# EAGLE design shield (EAGLE 6.1)
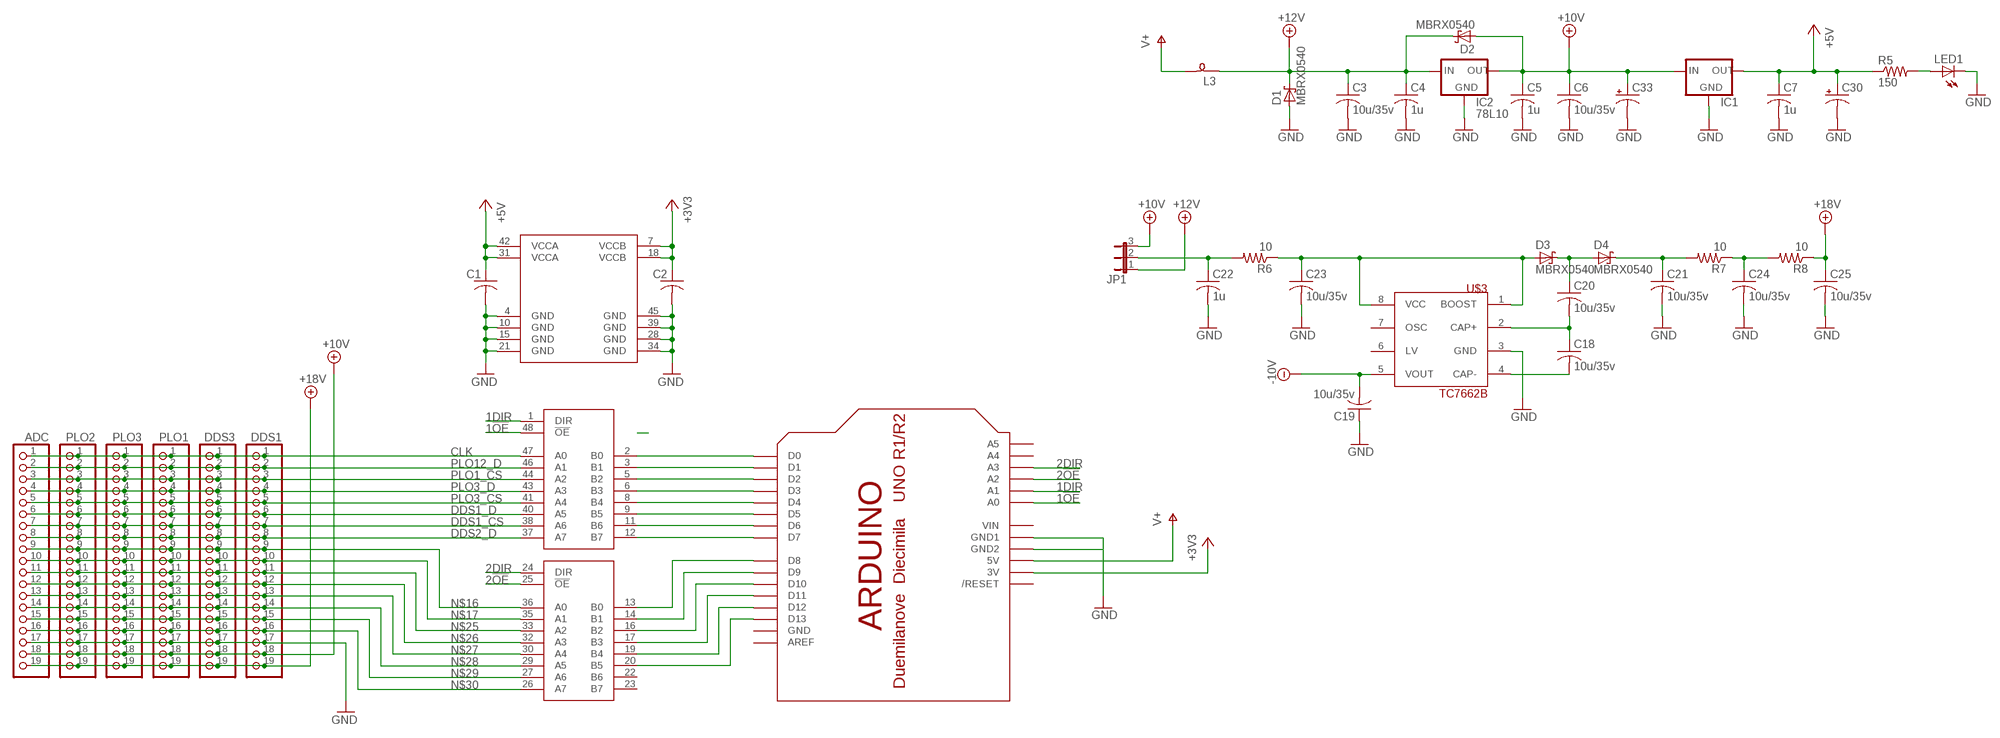
[diagram p0: schematic, sheet 1]

## Parts
ADC  PINHD-1X19  [1X19]
C1  C-USC0805  [C0805]
C2  C-USC0805  [C0805]
C3  10u/35v  C-USC1206  [C1206]
C4  1u  C-USC0603  [C0603]
C5  1u  C-USC0603  [C0603]
C6  10u/35v  C-USC1206  [C1206]
C7  1u  C-USC0603  [C0603]
C18  10u/35v  C-USC1206  [C1206]
C19  10u/35v  C-USC1206  [C1206]
C20  10u/35v  C-USC1206  [C1206]
C21  10u/35v  C-USC1206  [C1206]
C22  1u  C-USC0603  [C0603]
C23  10u/35v  C-USC1206  [C1206]
C24  10u/35v  C-USC1206  [C1206]
C25  10u/35v  C-USC1206  [C1206]
C30  CPOL-USE2.5-6  [E2,5-6]
C33  CPOL-USE2.5-6  [E2,5-6]
D1  MBRX0540  [SOD323-R]
D2  MBRX0540  [SOD323-R]
D3  MBRX0540  [SOD323-R]
D4  MBRX0540  [SOD323-R]
DDS1  PINHD-1X19  [1X19]
DDS3  PINHD-1X19  [1X19]
IC1  78MXXLSOT-89  [SOT89-BCE]
IC2  78L10  78XXS  [78XXS]
JP1  JP2E  [JP2]
L3  SM-B5  [SM-B5]
LED1  LED5MM  [LED5MM]
PLO1  PINHD-1X19  [1X19]
PLO2  PINHD-1X19  [1X19]
PLO3  PINHD-1X19  [1X19]
R5  150  R-US_R0603  [R0603]
R6  10  R-US_R0603  [R0603]
R7  10  R-US_R0603  [R0603]
R8  10  R-US_R0603  [R0603]
U$1  ARDUINO-NOHOLE  [ARDUINO-NOHOLE]
U$2  74ALVC164245DL  [SSO48]
U$3  TC7662B  [SO-08]

## Nets
1!OE: U$1.A0 U$2.48(1:!OE)
1DIR: U$1.A1 U$2.1(1:DIR)
2!OE: U$1.A2 U$2.25(2:!OE)
2DIR: U$1.A3 U$2.24(2:DIR)
+3V3: C2.1 U$1.3V U$2.7(VCCB) U$2.18(VCCB)
+5V: C1.1 C7.1 C30.+ IC1.B(OUT) R5.1 U$2.31(VCCA) U$2.42(VCCA)
+10V: ADC.18 C5.1 C6.1 C33.+ D2.A DDS1.18 DDS3.18 IC1.E(IN) IC2.OUT JP1.3 PLO1.18 PLO2.18 PLO3.18
+12V: C3.1 C4.1 D1.C D2.C IC2.IN JP1.1 L3.1
+18V: ADC.19 C25.1 DDS1.19 DDS3.19 PLO1.19 PLO2.19 PLO3.19 R8.1
-10V: C19.2 U$3.5(VOUT)
CLK: ADC.1 DDS1.1 DDS3.1 PLO1.1 PLO2.1 PLO3.1 U$2.47(1:A0)
DDS1_CS: ADC.7 DDS1.7 DDS3.7 PLO1.7 PLO2.7 PLO3.7 U$2.38(1:A6)
DDS1_D: ADC.6 DDS1.6 DDS3.6 PLO1.6 PLO2.6 PLO3.6 U$2.40(1:A5)
DDS2_D: ADC.8 DDS1.8 DDS3.8 PLO1.8 PLO2.8 PLO3.8 U$2.37(1:A7)
GND: ADC.17 C1.2 C2.2 C3.2 C4.2 C5.2 C6.2 C7.2 C19.1 C21.2 C22.2 C23.2 C24.2 C25.2 C30.- C33.- D1.A DDS1.17 DDS3.17 IC1.C(GND) IC2.GND LED1.K(C) PLO1.17 PLO2.17 PLO3.17 U$1.GND1 U$1.GND2 U$2.4(GND) U$2.10(GND) U$2.15(GND) U$2.21(GND) U$2.28(GND) U$2.34(GND) U$2.39(GND) U$2.45(GND) U$3.3(GND)
N$1: U$1.D8 U$2.13(2:B0)
N$2: U$1.D9 U$2.14(2:B1)
N$3: U$1.D10 U$2.16(2:B2)
N$4: U$1.D11 U$2.17(2:B3)
N$5: U$1.D12 U$2.19(2:B4)
N$6: U$1.D13 U$2.20(2:B5)
N$7: U$1.D7 U$2.12(1:B7)
N$8: U$1.D6 U$2.11(1:B6)
N$9: U$1.D5 U$2.9(1:B5)
N$10: U$1.D4 U$2.8(1:B4)
N$11: U$1.D3 U$2.6(1:B3)
N$12: U$1.D2 U$2.5(1:B2)
N$13: U$1.D1 U$2.3(1:B1)
N$14: U$1.D0 U$2.2(1:B0)
N$16: ADC.9 DDS1.9 DDS3.9 PLO1.9 PLO2.9 PLO3.9 U$2.36(2:A0)
N$17: ADC.10 DDS1.10 DDS3.10 PLO1.10 PLO2.10 PLO3.10 U$2.35(2:A1)
N$18: C22.1 JP1.2 R6.2
N$19: C23.1 D3.A R6.1 U$3.1(BOOST) U$3.8(VCC)
N$20: C18.2 U$3.4(CAP-)
N$21: C18.1 C20.2 U$3.2(CAP+)
N$22: C20.1 D3.C D4.A
N$23: C21.1 D4.C R7.2
N$24: C24.1 R7.1 R8.2
N$25: ADC.11 DDS1.11 DDS3.11 PLO1.11 PLO2.11 PLO3.11 U$2.33(2:A2)
N$26: ADC.12 DDS1.12 DDS3.12 PLO1.12 PLO2.12 PLO3.12 U$2.32(2:A3)
N$27: ADC.13 DDS1.13 DDS3.13 PLO1.13 PLO2.13 PLO3.13 U$2.30(2:A4)
N$28: ADC.14 DDS1.14 DDS3.14 PLO1.14 PLO2.14 PLO3.14 U$2.29(2:A5)
N$29: ADC.15 DDS1.15 DDS3.15 PLO1.15 PLO2.15 PLO3.15 U$2.27(2:A6)
N$30: ADC.16 DDS1.16 DDS3.16 PLO1.16 PLO2.16 PLO3.16 U$2.26(2:A7)
N$34: LED1.A R5.2
PLO1_CS: ADC.3 DDS1.3 DDS3.3 PLO1.3 PLO2.3 PLO3.3 U$2.44(1:A2)
PLO3_CS: ADC.5 DDS1.5 DDS3.5 PLO1.5 PLO2.5 PLO3.5 U$2.41(1:A4)
PLO3_D: ADC.4 DDS1.4 DDS3.4 PLO1.4 PLO2.4 PLO3.4 U$2.43(1:A3)
PLO12_D: ADC.2 DDS1.2 DDS3.2 PLO1.2 PLO2.2 PLO3.2 U$2.46(1:A1)
V+: L3.2 U$1.5V
Unconnected: U$1.A4 U$1.A5 U$1.AREF U$1.RESET(/RESET) U$2.22(2:B6) U$2.23(2:B7) U$3.6(LV) U$3.7(OSC)

## Power pins joined to a net without a drawn wire
GND: U$1.GND
VIN: U$1.VIN

## Library data of the parts
ADC DDS1 DDS3 PLO1-PLO3 = pinhead:PINHD-1X19: PIN HEADER
C1-C7 C18-C25 = rcl:C-US: CAPACITOR, American symbol
C30 C33 = rcl:CPOL-US: POLARIZED CAPACITOR, American symbol
D1-D4 = Misc:MBRX0540
IC1 = SLIM:78MXXL: VOLTAGE REGULATOR
IC2 = v-reg:78XXS: VOLTAGE REGULATOR
JP1 = jumper:JP2E: JUMPER
L3 = inductor-neosid:SM-B: INDUCTOR SMD Bead inductor; OC_FARNELL: unknown; OC_NEWARK: unknown
LED1 = led:LED: LED OSRAM: - CHIPLED LG R971, LG N971, LY N971, LG Q971, LY Q971, LO R971, LY R971 LH N974, LH R974 LS Q976, LO Q976, LY Q976 LO Q996 - Hyper CHIPLED LW Q18S LB Q993, LB Q99A, LB R99A - SideLED LS A670, LO A670, LY A670, LG A670, LP A670 LB A673, LV A673, LT A673, LW A673 LH A674 LY A675 LS A676, LA A676, LO A676, LY A676, LW A676 LS A679, LY A679, LG A679 - Hyper Micro SIDELED® LS Y876, LA Y876, LO Y876, LY Y876 LT Y87S - SmartLED LW L88C, LW L88S LB L89C, LB L89S, LG L890 LS L89K, LO L89K, LY L89K LS L896, LA L896, LO L896, LY L896 - TOPLED LS T670, LO T670, LY T670, LG T670, LP T670 LSG T670, LSP T670, LSY T670, LOP T670, LYG T670 LG T671, LOG T671, LSG T671 LB T673, LV T673, LT T673, LW T673 LH T674 LS T676, LA T676, LO T676, LY T676, LB T676, LH T676, LSB T676, LW T676 LB T67C, LV T67C, LT T67C, LS T67K, LO T67K, LY T67K, LW E67C LS E67B, LA E67B, LO E67B, LY E67B, LB E67C, LV E67C, LT E67C LW T67C LS T679, LY T679, LG T679 LS T770, LO T770, LY T770, LG T770, LP T770 LB T773, LV T773, LT T773, LW T773 LH T774 LS E675, LA E675, LY E675, LS T675 LS T776, LA T776, LO T776, LY T776, LB T776 LHGB T686 LT T68C, LB T68C - Hyper Mini TOPLED® LB M676 - Mini TOPLED Santana® LG M470 LS M47K, LO M47K, LY M47K Source: http://www.osram.convergy.de LUXEON: - LUMILED® LXK2-PW12-R00, LXK2-PW12-S00, LXK2-PW14-U00, LXK2-PW14-V00 LXK2-PM12-R00, LXK2-PM12-S00, LXK2-PM14-U00 LXK2-PE12-Q00, LXK2-PE12-R00, LXK2-PE12-S00, LXK2-PE14-T00, LXK2-PE14-U00 LXK2-PB12-K00, LXK2-PB12-L00, LXK2-PB12-M00, LXK2-PB14-N00, LXK2-PB14-P00, LXK2-PB14-Q00 LXK2-PR12-L00, LXK2-PR12-M00, LXK2-PR14-Q00, LXK2-PR14-R00 LXK2-PD12-Q00, LXK2-PD12-R00, LXK2-PD12-S00 LXK2-PH12-R00, LXK2-PH12-S00 LXK2-PL12-P00, LXK2-PL12-Q00, LXK2-PL12-R00 Source: www.luxeon.com KINGBRIGHT: KA-3528ASYC Source: www.kingbright.com
R5-R8 = rcl:R-US_: RESISTOR, American symbol
U$1 = adafruit:ARDUINO: Arduino Diecimila/Duemilanove Make a shield with ease, this package has all the named pins as well as the two mounting drill holes and an outline of the USB and DC power connector. The outline is on the DIMENSION layer, so if your board house uses it they will cut the outline to match. http://www.ladyada.net/library/pcb/eaglelibrary.html
U$2 = Misc:74ALVC164245
U$3 = microchip:TC7662B

## Board
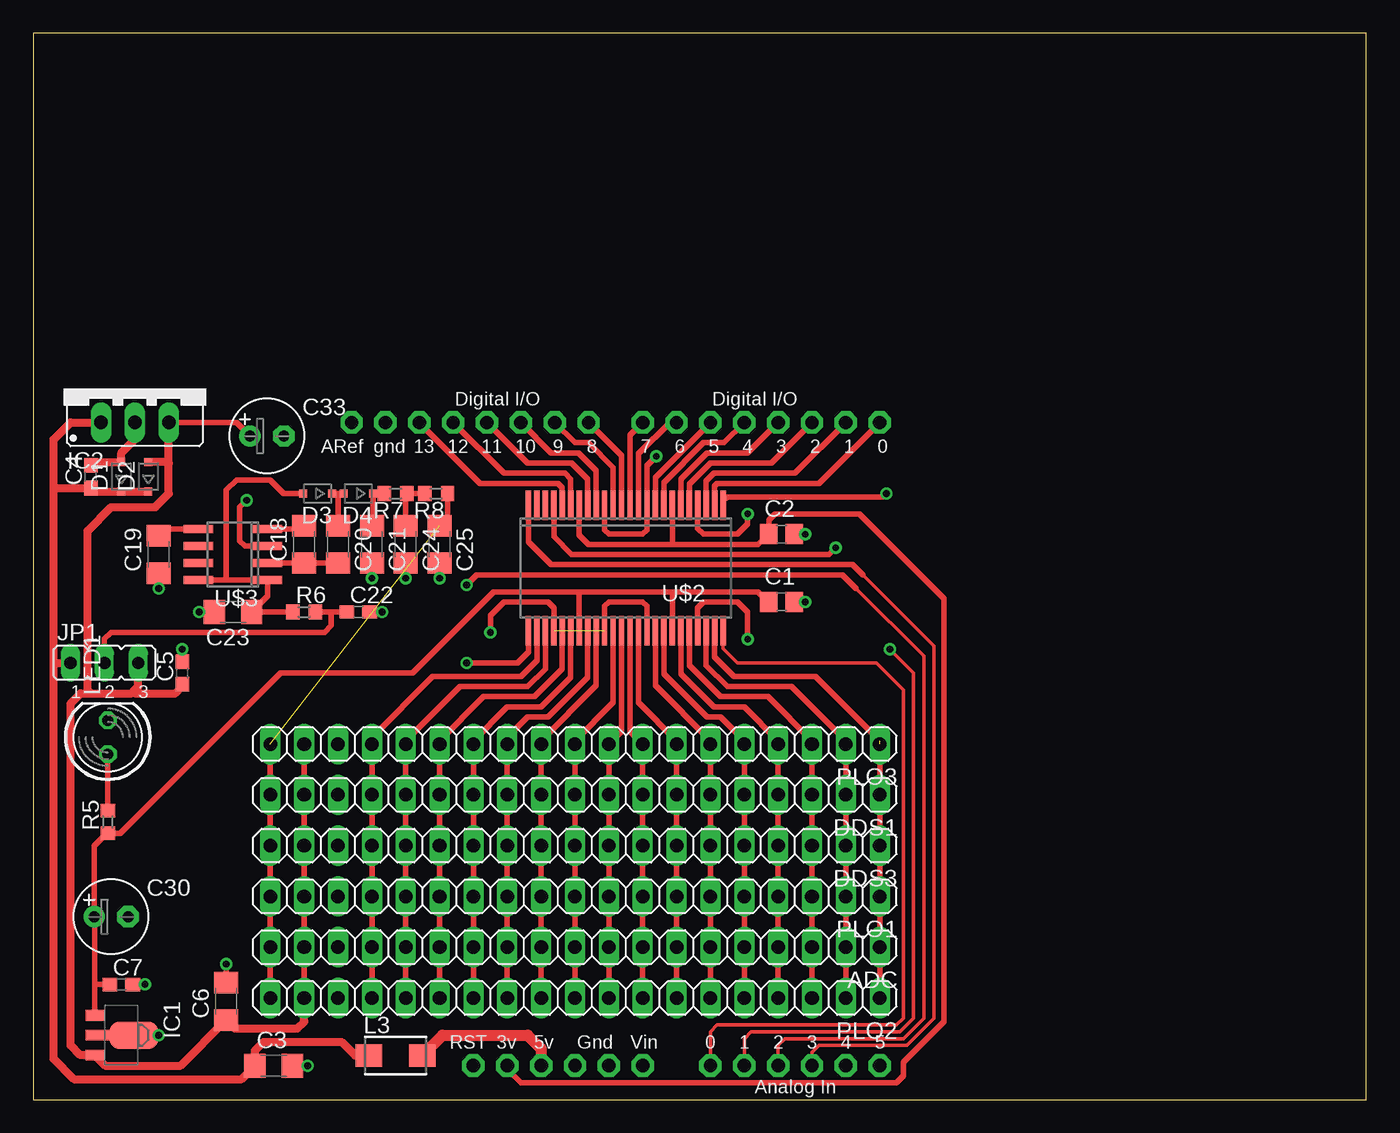
[diagram p1: board, top side]
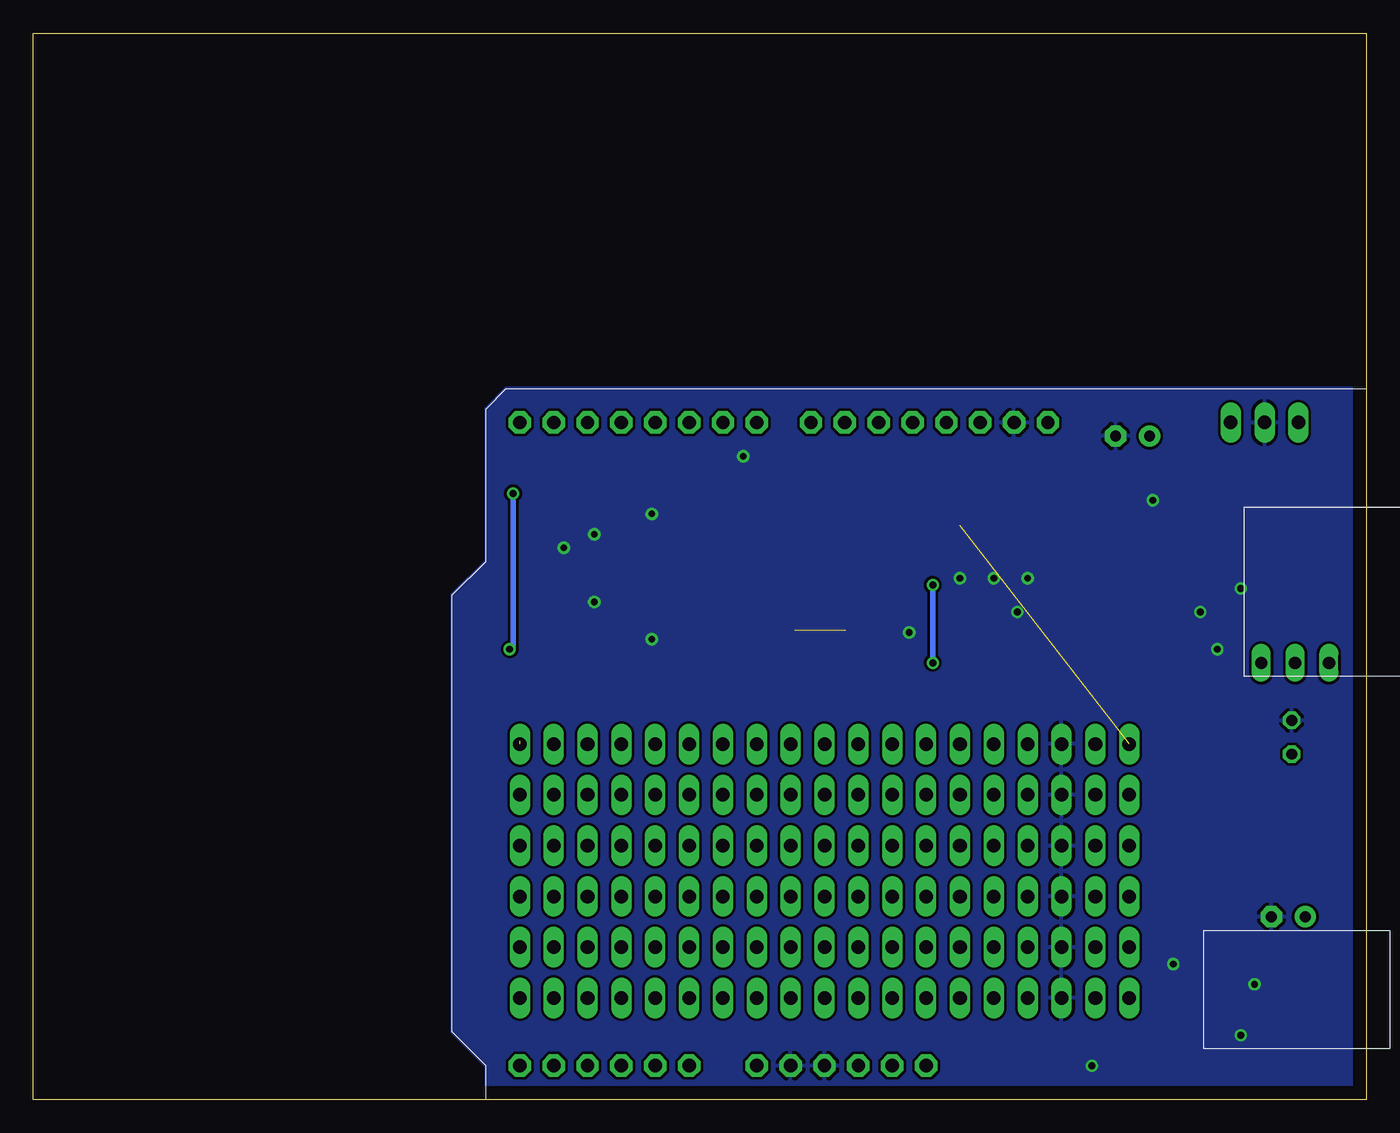
[diagram p2: board, bottom side, seen from below]

Size 100 x 80 mm. Coordinates in mm from the lower left corner, seen from the top.
Outline: 0,0 100,0 100,80 0,80 0,0
Copper layers (1*16): Top 0.035mm / dielectric 1.5mm / Bottom 0.035mm
Design rules: minimum track width 10mil, minimum drill 24mil, track to track 8mil, track to pad 8mil, pad to pad 8mil, via to via 8mil, smd to smd 8mil, copper to edge 40mil, drill to drill 8mil, minimum pad ring 10mil, minimum via ring 8mil, stop-mask expansion 4mil, vias tented up to drill 0mil, thermal gap 10mil

### Footprints (pad centres in the part's own frame; a part is rotated, then mirrored left to right if it is on the bottom)
1X19 = drill 1.016 long: 1 -22.86,0; 2 -20.32,0; 3 -17.78,0; 4 -15.24,0; 5 -12.7,0; 6 -10.16,0; 7 -7.62,0; 8 -5.08,0; 9 -2.54,0; 10 0,0; 11 2.54,0; 12 5.08,0; 13 7.62,0; 14 10.16,0; 15 12.7,0; 16 15.24,0; 17 17.78,0; 18 20.32,0; 19 22.86,0
C0805 = smd 1.3 x 1.5: 1 -0.95,0; 2 0.95,0
C1206 = smd 1.6 x 1.8: 1 -1.4,0; 2 1.4,0
C0603 = smd 1.1 x 1: 1 -0.85,0; 2 0.85,0
E2,5-6 = drill 0.813 pad 1.6: + -1.27,0 | drill 0.813 pad 1.6 octagon: - 1.27,0
SOD323-R = smd 0.6 x 0.6: A 1.1,0; C -1.1,0
SOT89-BCE = smd 0.8 x 1.4: B -1.499,-1.981; E 1.499,-1.981 | smd 0.8 x 1.9: C 0,-1.727 | smd 2.032 x 3.65: C@1 0,0.94
78XXS = drill 1.016 long: GND 0,-2.54; IN -2.54,-2.54; OUT 2.54,-2.54
JP2 = drill 0.914 long: 1 -2.54,0; 2 0,0; 3 2.54,0
SM-B5 = smd 2 x 1.7: 1 -2,0; 2 2,0
LED5MM = drill 0.813 octagon: A -1.27,0; K 1.27,0
R0603 = smd 1 x 1.1: 1 -0.85,0; 2 0.85,0
ARDUINO-NOHOLE = drill 1 pad 1.676 octagon: 3V 35.56,2.54; 5V 38.1,2.54; A0 50.8,2.54; A1 53.34,2.54; A2 55.88,2.54; A3 58.42,2.54; A4 60.96,2.54; A5 63.5,2.54; AREF 23.876,50.8; D0 63.5,50.8; D1 60.96,50.8; D2 58.42,50.8; D3 55.88,50.8; D4 53.34,50.8; D5 50.8,50.8; D6 48.26,50.8; D7 45.72,50.8; D8 41.656,50.8; D9 39.116,50.8; D10 36.576,50.8; D11 34.036,50.8; D12 31.496,50.8; D13 28.956,50.8; GND 26.416,50.8; GND1 43.18,2.54; GND2 40.64,2.54; RESET 33.02,2.54; VIN 45.72,2.54
SSO48 = smd 0.4 x 2.2: 1 -7.303,-4.7; 2 -6.668,-4.7; 3 -6.033,-4.7; 4 -5.398,-4.7; 5 -4.763,-4.7; 6 -4.128,-4.7; 7 -3.493,-4.7; 8 -2.858,-4.7; 9 -2.223,-4.7; 10 -1.588,-4.7; 11 -0.953,-4.7; 12 -0.318,-4.7; 13 0.318,-4.7; 14 0.953,-4.7; 15 1.588,-4.7; 16 2.223,-4.7; 17 2.858,-4.7; 18 3.493,-4.7; 19 4.128,-4.7; 20 4.763,-4.7; 21 5.398,-4.7; 22 6.033,-4.7; 23 6.668,-4.7; 24 7.303,-4.7; 25 7.303,4.7; 26 6.668,4.7; 27 6.033,4.7; 28 5.398,4.7; 29 4.763,4.7; 30 4.128,4.7; 31 3.493,4.7; 32 2.858,4.7; 33 2.223,4.7; 34 1.588,4.7; 35 0.953,4.7; 36 0.318,4.7; 37 -0.318,4.7; 38 -0.953,4.7; 39 -1.588,4.7; 40 -2.223,4.7; 41 -2.858,4.7; 42 -3.493,4.7; 43 -4.128,4.7; 44 -4.763,4.7; 45 -5.398,4.7; 46 -6.033,4.7; 47 -6.668,4.7; 48 -7.303,4.7
SO-08 = smd 0.6 x 2.2: 1 -1.905,-2.6; 2 -0.635,-2.6; 3 0.635,-2.6; 4 1.905,-2.6; 5 1.905,2.6; 6 0.635,2.6; 7 -0.635,2.6; 8 -1.905,2.6

### Placement (x,y rotation side)
ADC  40.64,11.43 180 top
C1  56.13,37.34 0 top
C2  56.13,42.42 0 top
C3  18.03,2.54 0 top
C4  4.32,46.74 90 top
C5  11.18,32 90 top
C6  14.48,7.37 90 top
C7  6.6,8.64 0 top
C18  20.32,41.66 90 top
C19  9.4,40.89 90 top
C20  22.86,41.66 270 top
C21  25.4,41.66 270 top
C22  24.38,36.58 0 top
C23  14.99,36.58 180 top
C24  27.94,41.66 270 top
C25  30.48,41.66 270 top
C30  5.84,13.72 0 top
C33  17.53,49.78 0 top
D1  6.6,46.74 90 top
D2  8.64,46.74 90 top
D3  21.34,45.47 180 top
D4  24.38,45.47 180 top
DDS1  40.64,22.86 180 top
DDS3  40.64,19.05 180 top
IC1  6.6,4.83 270 top
IC2  7.62,53.34 0 top
JP1  5.33,32.77 0 top
L3  27.18,3.3 0 top
LED1  5.59,27.18 90 top
PLO1  40.64,15.24 180 top
PLO2  40.64,7.62 180 top
PLO3  40.64,26.67 180 top
R5  5.59,20.83 90 top
R6  20.32,36.58 0 top
R7  27.18,45.47 180 top
R8  30.23,45.47 180 top
U$1  0,0 0 top
U$2  44.45,39.88 180 top
U$3  14.99,40.89 90 top

### Tracks (layer width: path | path; a pad name or v marks a point on that pad's centre or on a via)
1!OE
  Top 0.254: U$1.A0 50.8,5.08 51.31,5.59 64.77,5.59 65.28,6.1 65.28,30.73 63.25,32.77 52.83,32.77 51.75,33.84 U$2.48
1DIR  (via drill 0.51)
  Top 0.254: U$1.A1 53.34,4.57 53.85,5.08 65.02,5.08 66.04,6.1 66.04,32 v64.26,33.78
  Top 0.406: U$2.1 51.75,44.9 52.07,45.21 63.75,45.21 v64.01,45.47
  Bottom 0.406: v64.01,45.47 64.01,34.04 v64.26,33.78
2!OE  (via drill 0.51)
  Top 0.254: U$1.A2 55.88,4.06 56.39,4.57 65.28,4.57 66.8,6.1 66.8,33.27 61.72,38.35
  Top 0.406: U$2.25 37.15,33.59 36.32,32.77 v32.51,32.77 | v32.51,38.61 33.27,39.37 60.71,39.37 61.72,38.35
  Bottom 0.406: v32.51,32.77 v32.51,38.61
2DIR
  Top 0.254: U$1.A3 58.42,3.56 58.93,4.06 65.53,4.06 67.56,6.1 67.56,34.04 62.23,39.37
  Top 0.406: U$2.24 37.15,41.85 38.86,40.13 61.47,40.13 62.23,39.37
+3V3
  Top 0.305: 48.01,41.66 47.94,41.72
  Top 0.406: U$2.18 40.96,42.35 41.66,41.66 48.01,41.66 54.36,41.66 55.12,42.42 C2.1 55.18,43.5 55.63,43.94 61.98,43.94 68.33,37.59 68.33,5.84 65.28,2.79 65.28,1.78 64.77,1.27 36.58,1.27 35.56,2.29 U$1.3V | 47.94,41.72 U$2.7
+5V
  Top 0.305: 48.01,38.1 47.94,38.04
  Top 0.406: C1.1 55.12,37.34 54.36,38.1 48.01,38.1 40.89,38.1 | 47.94,38.04 U$2.42 | IC1.B 4.62,8.64 | 4.62,8.64 4.62,13.66 | 4.62,8.64 C7.1 | C30.+ 4.57,19.05 5.5,19.98 | R5.1 6.52,19.98 18.54,32 28.45,32 34.54,38.1 40.89,38.1 | U$2.31 40.96,38.04 40.89,38.1
  Top 0.813: 4.62,13.66 C30.+ | 5.5,19.98 R5.1
+10V
  Top 0.406: IC2.OUT 15.24,50.8 C33.+ | PLO2.18 ADC.18 PLO1.18 DDS3.18 DDS1.18 PLO3.18
  Top 0.61: JP1.3 7.87,30.99 7.49,30.61 | 7.49,30.61 7.37,30.48 4.32,30.48 | 4.32,30.48 3.56,30.48 2.79,29.72 2.79,4.06 3.53,3.33 IC1.E 5.41,2.54 11.05,2.54 C6.1 15.11,5.33 19.81,5.33 20.32,5.84 PLO2.18 | 10.16,47.75 10.16,45.47 9.14,44.45 5.84,44.45 4.06,42.67 4.06,30.73 4.32,30.48 | 10.16,47.75 IC2.OUT | C5.1 11.18,30.99 10.67,30.48 7.62,30.48 7.49,30.61 | D2.A 10.08,47.84 10.16,47.75
+12V
  Top 0.61: 1.52,32.77 1.52,3.05 3.05,1.52 15.62,1.52 C3.1 16.63,3.68 17.27,4.32 23.11,4.32 24.13,3.3 L3.1 | 1.52,32.77 1.52,45.97 | 1.52,45.97 1.52,49.53 2.79,50.8 IC2.IN | 1.52,32.77 JP1.1 | D2.C D1.C 4.57,45.64 C4.1 1.61,45.89 1.52,45.97
+18V  (1 unrouted)
  Top 0.406: PLO2.19 ADC.19 PLO1.19 DDS3.19 DDS1.19 PLO3.19 | R8.1 31.08,43.65 C25.1
-10V
  Top 0.305: C19.2 9.9,42.8
  Top 0.406: 9.9,42.8 U$3.5
CLK  (1 unrouted)
  Top 0.406: U$2.47 51.12,33.21 52.58,31.75 58.67,31.75 63.5,26.92 | PLO3.1 DDS1.1 DDS3.1 PLO1.1 ADC.1 PLO2.1
DDS1_CS
  Top 0.406: U$2.38 45.4,29.78 48.26,26.92 PLO3.7 DDS1.7 DDS3.7 PLO1.7 ADC.7 PLO2.7
DDS1_D
  Top 0.406: U$2.40 46.67,31.05 50.8,26.92 PLO3.6 DDS1.6 DDS3.6 PLO1.6 ADC.6 PLO2.6
DDS2_D
  Top 0.406: U$2.37 44.77,27.62 PLO3.8 DDS1.8 DDS3.8 PLO1.8 ADC.8 PLO2.8
GND  (via drill 0.51)  (1 unrouted)
  Top 0.406: v46.74,48.26 46.04,47.56 U$2.10 46.04,42.74 45.72,42.42 43.18,42.42 42.86,42.74 U$2.15 | U$2.4 49.85,42.86 50.29,42.42 52.83,42.42 53.59,43.18 v53.59,43.94 | C2.2 v57.91,42.42 | C1.2 v57.91,37.34 | U$2.45 49.85,36.89 50.29,37.34 52.83,37.34 53.59,36.58 v53.59,34.54 | U$2.28 39.05,36.89 38.61,37.34 35.31,37.34 34.29,36.32 v34.29,35.05 | U$2.34 42.86,37.02 43.18,37.34 45.72,37.34 46.04,37.02 U$2.39 | U$3.3 15.88,41.53 15.49,41.91 15.49,44.45 v16,44.96 | C21.2 v25.4,39.12 | C24.2 v27.94,39.12 | C25.2 v30.48,39.12 | C22.2 v26.16,36.58 | v12.45,36.58 C23.2 | C19.1 v9.4,38.35 | C5.2 v11.18,33.78 | C6.2 v14.48,10.16 | IC1.C v9.4,4.83 | C7.2 v8.38,8.64 | U$2.21 39.05,42.23 40.39,40.89 59.69,40.89 v60.2,41.4
  Top 0.61: C3.2 v20.57,2.54 | IC2.GND 7.62,49.53 6.6,48.51 D1.A 4.57,47.84 C4.2
  pour Bottom: 0,53.34 64.52,53.34 66.04,51.82 66.04,40.39 68.58,37.85 68.58,5.08 66.04,2.54 66.04,0 0,0
N$1
  Top 0.406: U$2.13 44.13,48.32 U$1.D8
N$2
  Top 0.406: U$2.14 43.5,47.44 41.66,49.28 40.64,49.28 U$1.D9
N$3
  Top 0.406: U$2.16 42.23,47.18 40.89,48.51 38.86,48.51 U$1.D10
N$4
  Top 0.406: U$2.17 41.59,46.55 40.39,47.75 37.08,47.75 U$1.D11
N$5
  Top 0.406: U$2.19 40.32,46.55 39.88,46.99 35.31,46.99 U$1.D12
N$6
  Top 0.406: U$2.20 39.69,45.91 39.37,46.23 33.53,46.23 U$1.D13
N$7
  Top 0.406: U$2.12 44.77,49.85 U$1.D7
N$8
  Top 0.406: U$2.11 45.4,48.45 47.75,50.8 U$1.D6
N$9
  Top 0.406: U$2.9 46.67,46.67 U$1.D5
N$10
  Top 0.406: U$2.8 47.31,46.29 50.29,49.28 51.82,49.28 U$1.D4
N$11
  Top 0.406: U$2.6 48.58,46.55 50.55,48.51 53.59,48.51 U$1.D3
N$12
  Top 0.406: U$2.5 49.21,46.16 50.8,47.75 55.37,47.75 U$1.D2
N$13
  Top 0.406: U$2.3 50.48,46.42 51.05,46.99 57.15,46.99 U$1.D1
N$14
  Top 0.406: U$2.2 51.12,46.04 51.31,46.23 58.93,46.23 U$1.D0
N$16
  Top 0.406: U$2.36 44.13,27.62 PLO3.9 DDS1.9 DDS3.9 PLO1.9 ADC.9 PLO2.9
N$17
  Top 0.406: U$2.35 43.5,29.78 40.64,26.92 PLO3.10 DDS1.10 DDS3.10 PLO1.10 ADC.10 PLO2.10
N$18
  Top 0.406: JP1.2 5.33,34.54 5.84,35.05 21.84,35.05 22.35,35.56 22.35,36.58 | 22.35,36.58 R6.2 | 22.35,36.58 C22.1
N$19
  Top 0.406: U$3.8 14.48,38.99 | 14.48,38.99 U$3.1 17.59,37.78 C23.1 R6.1 | D3.A 18.8,45.47 17.78,46.48 15.24,46.48 14.48,45.72 14.48,38.99
N$20
  Top 0.305: 20.06,42.8 C18.2
  Top 0.406: U$3.4 20.06,42.8
N$21
  Top 0.305: C18.1
  Top 0.406: U$3.2 C18.1 | C18.1 C20.2
N$22
  Top 0.406: D3.C 22.86,45.47 | 22.86,45.47 D4.A | 22.86,45.47 C20.1
N$23
  Top 0.406: C21.1 25.48,43.14 D4.C R7.2
N$24
  Top 0.406: R8.2 R7.1 27.94,45.38 C24.1
N$25
  Top 0.406: U$2.33 42.23,31.05 38.1,26.92 PLO3.11 DDS1.11 DDS3.11 PLO1.11 ADC.11 PLO2.11
N$26
  Top 0.406: U$2.32 41.59,31.69 38.61,28.7 37.08,28.7 35.56,27.18 PLO3.12 DDS1.12 DDS3.12 PLO1.12 ADC.12 PLO2.12
N$27
  Top 0.406: U$2.30 40.32,31.69 38.1,29.46 35.56,29.46 33.02,26.92 PLO3.13 DDS1.13 DDS3.13 PLO1.13 ADC.13 PLO2.13
N$28
  Top 0.406: U$2.29 39.69,32.32 37.59,30.23 33.78,30.23 30.48,26.92 PLO3.14 DDS1.14 DDS3.14 PLO1.14 ADC.14 PLO2.14
N$29
  Top 0.406: U$2.27 38.42,32.32 37.08,30.99 32,30.99 27.94,26.92 PLO3.15 DDS1.15 DDS3.15 PLO1.15 ADC.15 PLO2.15
N$30
  Top 0.406: U$2.26 37.78,32.96 36.58,31.75 29.97,31.75 25.4,27.18 PLO3.16 DDS1.16 DDS3.16 PLO1.16 ADC.16 PLO2.16
N$34
  Top 0.406: R5.2 LED1.A
PLO1_CS
  Top 0.406: U$2.44 49.21,32.58 51.56,30.23 55.12,30.23 58.42,26.92 PLO3.3 DDS1.3 DDS3.3 PLO1.3 ADC.3 PLO2.3
PLO3_CS
  Top 0.406: U$2.41 47.31,31.94 50.55,28.7 51.56,28.7 53.34,26.92 PLO3.5 DDS1.5 DDS3.5 PLO1.5 ADC.5 PLO2.5
PLO3_D
  Top 0.406: U$2.43 48.58,31.94 51.05,29.46 53.34,29.46 55.88,26.92 PLO3.4 DDS1.4 DDS3.4 PLO1.4 ADC.4 PLO2.4
PLO12_D
  Top 0.406: U$2.46 50.48,32.58 52.07,30.99 56.9,30.99 60.96,26.92 PLO3.2 DDS1.2 DDS3.2 PLO1.2 ADC.2 PLO2.2
V+
  Top 0.813: U$1.5V 38.1,3.81 37.08,4.83 30.7,4.83 L3.2